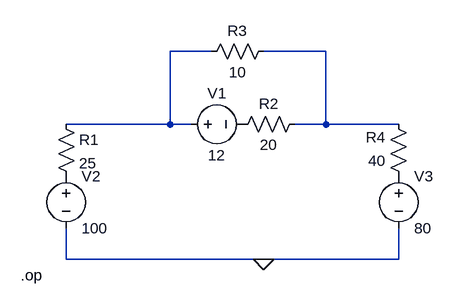
[diagram p0: schematic Draft2.asc]
Draft2.asc, the LTspice schematic file:
Version 4
SHEET 1 880 680
WIRE 144 16 80 16
WIRE 320 16 224 16
WIRE 80 128 80 16
WIRE 80 128 -80 128
WIRE 112 128 80 128
WIRE 320 128 320 16
WIRE 320 128 272 128
WIRE 432 128 320 128
WIRE -80 336 -80 288
WIRE 224 336 -80 336
WIRE 432 336 432 288
WIRE 432 336 224 336
FLAG 224 336 0
SYMBOL voltage 96 128 M90
WINDOW 0 -32 56 VBottom 2
WINDOW 3 32 56 VTop 2
WINDOW 123 0 0 Left 0
WINDOW 39 0 0 Left 0
SYMATTR InstName V1
SYMATTR Value 12
SYMBOL res -96 112 R0
SYMATTR InstName R1
SYMATTR Value 25
SYMBOL res 288 112 R90
WINDOW 0 0 56 VBottom 2
WINDOW 3 32 56 VTop 2
SYMATTR InstName R2
SYMATTR Value 20
SYMBOL res 240 0 R90
WINDOW 0 0 56 VBottom 2
WINDOW 3 32 56 VTop 2
SYMATTR InstName R3
SYMATTR Value 10
SYMBOL res 448 224 R180
WINDOW 0 36 76 Left 2
WINDOW 3 36 40 Left 2
SYMATTR InstName R4
SYMATTR Value 40
SYMBOL voltage -80 192 R0
WINDOW 123 0 0 Left 0
WINDOW 39 0 0 Left 0
SYMATTR InstName V2
SYMATTR Value 100
SYMBOL voltage 432 192 R0
WINDOW 123 0 0 Left 0
WINDOW 39 0 0 Left 0
SYMATTR InstName V3
SYMATTR Value 80
TEXT -150 360 Left 2 !.op

The netlist it stands for:
* Draft2.asc
V1 N001 P001 12
R1 N001 P002 25
R2 N002 P001 20
R3 N002 N001 10
R4 P003 N002 40
V2 P002 0 100
V3 P003 0 80
.op
.backanno
.end